# EAGLE schematic testBoard2 (EAGLE 8.6.0)
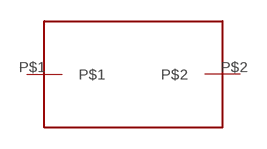
[diagram p0: schematic, sheet 1]

## Parts
U$1  CJV23-SOLENOID-VALVE  [CJV23]
Unconnected: U$1.P$1 U$1.P$2

## Library data of the parts
U$1 = programmable-air-components:CJV23-SOLENOID-VALVE: CJV23 solenoid valve